# Altium schematic sheet Схема электрическая принципиальная.SchDoc
size 1499 x 1499 mm
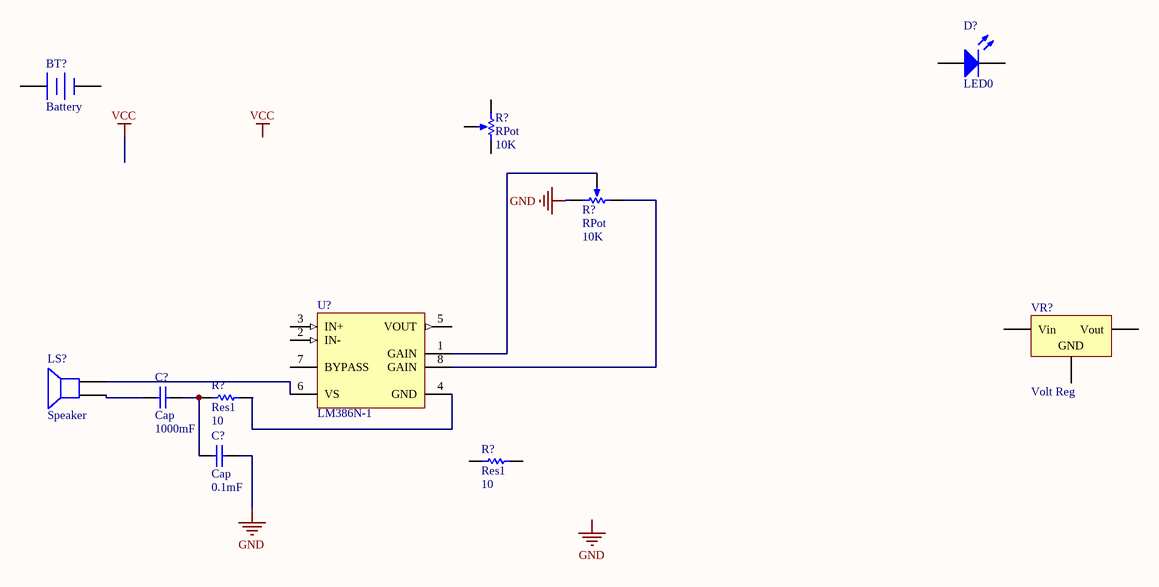
[diagram p0: Схема электрическая принципиальная.SchDoc]

## Parts
(Parts that share a designator on the sheet are numbered #1, #2 ... from top to bottom, then left to right.)
BT?  Battery  [BAT-2]
C?#1  Cap  value 1000mF  [RAD-0.3]
C?#2  Cap  value 0.1mF  [RAD-0.3]
D?  LED0  [LED-0]
LS?  Speaker  [PIN2]
R?#1  RPot  value 10K  [VR5]
R?#2  RPot  value 10K  [VR5]
R?#3  Res1  value 10  [AXIAL-0.3]
R?#4  Res1  value 10  [AXIAL-0.3]
U?  LM386N-1  [N08E]
VR?  Volt Reg  [D2PAK_N]

## Nets
GND: C?#2.2 R?#2.2(BOT)
NetC?#1_1: C?#1.1 LS?.1
NetC?#1_2: C?#1.2 C?#2.1 R?#3.1
NetLS?_2: LS?.2 U?.6(VS)
NetR?#2_1: R?#2.1(TOP) U?.8(GAIN)
NetR?#2_3: R?#2.3(TAP) U?.1(GAIN)
NetR?#3_2: R?#3.2 U?.4(GND)

Not connected (* = marked no-connect by the designer): BT? 1(+) 2(-); D? 1(A) 2(K); R?#1 1(TOP) 2(BOT) 3(TAP); R?#4 1 2; U? 2(IN-) 3(IN+) 5(VOUT) 7(BYPASS); VR? 1(Vin) 2(GND) 3(Vout)

## Notes on the sheet
- Labels drawn without touching a wire or pin: GND, VCC

## Library data of the parts
BT? = Battery: Multicell Battery; Published: 24-Mar-1999; LatestRevisionDate: 17-Jul-2002; LatestRevisionNote: Re-released for DXP Platform.; PackageReference: BAT-2; Publisher: Altium Limited; PackageDescription: Battery; 2 Leads
C?#1 C?#2 = Cap: Capacitor; Published: 8-Jun-2000; LatestRevisionDate: 17-Jul-2002; LatestRevisionNote: Re-released for DXP Platform.; PackageReference: RAD-0.3; Publisher: Altium Limited; PackageDescription: Radial Cap, Thru-Hole; 2 Leads; 0.3 in Pin Spacing
D? = LED0: Typical INFRARED GaAs LED; Published: 8-Jun-2000; LatestRevisionDate: 08-Jul-2005; LatestRevisionNote: Mech Layer 1 removed.; PackageReference: LED-0; Publisher: Altium Limited; PackageDescription: LED; 2 Leads
LS? = Speaker: Loudspeaker; Published: 24-Mar-1999; LatestRevisionDate: 17-Jul-2002; LatestRevisionNote: Re-released for DXP Platform.; PackageReference: PIN2; Publisher: Altium Limited
R?#1 R?#2 = RPot: Potentiometer; Sim Note: Enter the Resistance value and the set point into parameter fields.; Set Position: 0.5; Published: 8-Jun-2000; LatestRevisionDate: 17-Jul-2002; LatestRevisionNote: Re-released for DXP Platform.; PackageReference: VR5; Publisher: Altium Limited; PackageDescription: Variable Resistor, Thru-Hole; 3 Leads
R?#3 R?#4 = Res1: Resistor; Published: 8-Jun-2000; LatestRevisionDate: 17-Jul-2002; LatestRevisionNote: Re-released for DXP Platform.; PackageReference: AXIAL-0.3; Publisher: Altium Limited; PackageDescription: Axial Device, Thru-Hole; 2 Leads; 0.3 in Pin Spacing
U? = LM386N-1: Low Voltage Audio Power Amplifier, 8-pin MDIP; Manufacturer: National Semiconductor; PackageTopMarking: NSUZXYTTE#*LM*386N-1; PowerWise: N; CompType: Audio IC; High-Reliability: Y; DatasheetVersion: Aug-2000; PackageVersion: revG, May-2006; PackageReference: N08E; PackageDescription: MDIP, .365 x .250 x .130in, 8 Lead, .100in Pitch; PartNumber: LM386N-1; RoHS: N; PinCount: 8; Code_JEDEC: MS-001-BA; ComponentLink1Description: Manufacturer URL; ComponentLink1URL: http://www.national.com/; ComponentLink2Description: LM386 Datasheet; ComponentLink2URL: http://www.national.com/ds/LM/LM386.pdf; ComponentLink3Description: LM386 Web Page; ComponentLink3URL: http://www.national.com/pf/LM/LM386.html; ComponentLink4Description: N08E Package Page; ComponentLink4URL: http://www.national.com/packaging/folders/n08e.html
VR? = Volt Reg: Voltage Regulator; Published: 24-Mar-1999; LatestRevisionDate: 29-May-2009; LatestRevisionNote: IPC-7351 Footprint Added.; PackageReference: D2PAK; Publisher: Altium Limited; PackageDescription: 3-Pin Transistor Outline Package 2.54 mm Pitch, 15.1 mm Lead Span